# Altium schematic sheet RJ45.SchDoc
size A4
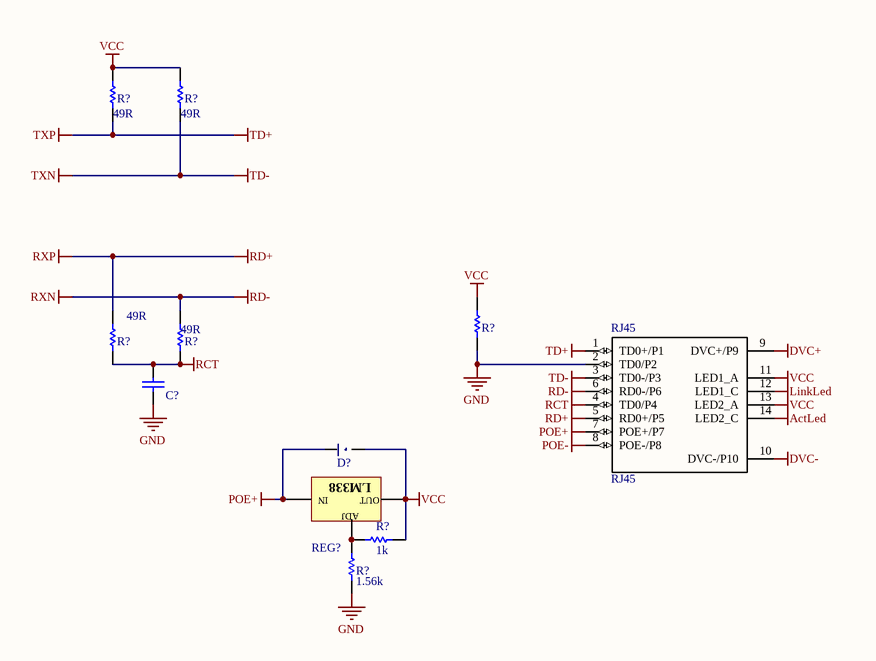
[diagram p0: RJ45.SchDoc]

## Parts
(Parts that share a designator on the sheet are numbered #1, #2 ... from top to bottom, then left to right.)
C?  Capacitor de paso  [Capacitor de paso 1]  (value not drawn)
D?  Diodo  [1n400X]  (value not drawn)
R?#1  49R  [Resistor 1/4 W]
R?#2  49R  [Resistor 1/4 W]
R?#3  Resistor  [Resistor 1/4 W]  (value not drawn)
R?#4  49R  [Resistor 1/4 W]
R?#5  49R  [Resistor 1/4 W]
R?#6  1k  [Resistor 1/4 W]
R?#7  1.56k  [Resistor 1/4 W]
REG?  LM338  [TO-220 + Heatsink]  (value not drawn)
RJ45  RJ45  [RJ45]

## Nets
ActLed: RJ45.14(LED2_C)
DVC+: RJ45.9(DVC+/P9)
DVC-: RJ45.10(DVC-/P10)
GND: C?.1 R?#3.2 R?#7.1 RJ45.2(TD0/P2)
LinkLed: RJ45.12(LED1_C)
POE+: D?.2 REG?.3 RJ45.7(POE+/P7)
POE-: RJ45.8(POE-/P8)
RCT: C?.2 R?#4.1 R?#5.1 RJ45.4(TD0/P4)
RD+: R?#4.2 RJ45.5(RD0+/P5)  [also labelled RXP]
RD-: R?#5.2 RJ45.6(RD0-/P6)  [also labelled RXN]
TD+: R?#1.2 RJ45.1(TD0+/P1)  [also labelled TXP]
TD-: R?#2.2 RJ45.3(TD0-/P3)  [also labelled TXN]
VCC: D?.1 R?#1.1 R?#2.1 R?#3.1 R?#6.1 REG?.2 RJ45.11(LED1_A) RJ45.13(LED2_A)
NetR?#6_2: R?#6.2 R?#7.2 REG?.1

## Notes on the sheet
- (in symbol LM338) IN; OUT; ADJ

## Library data of the parts
R?#1 R?#2 R?#4-R?#7 = Resistor
REG? = LM338: Variable Voltage Regulator
RJ45 = RJ45Poe